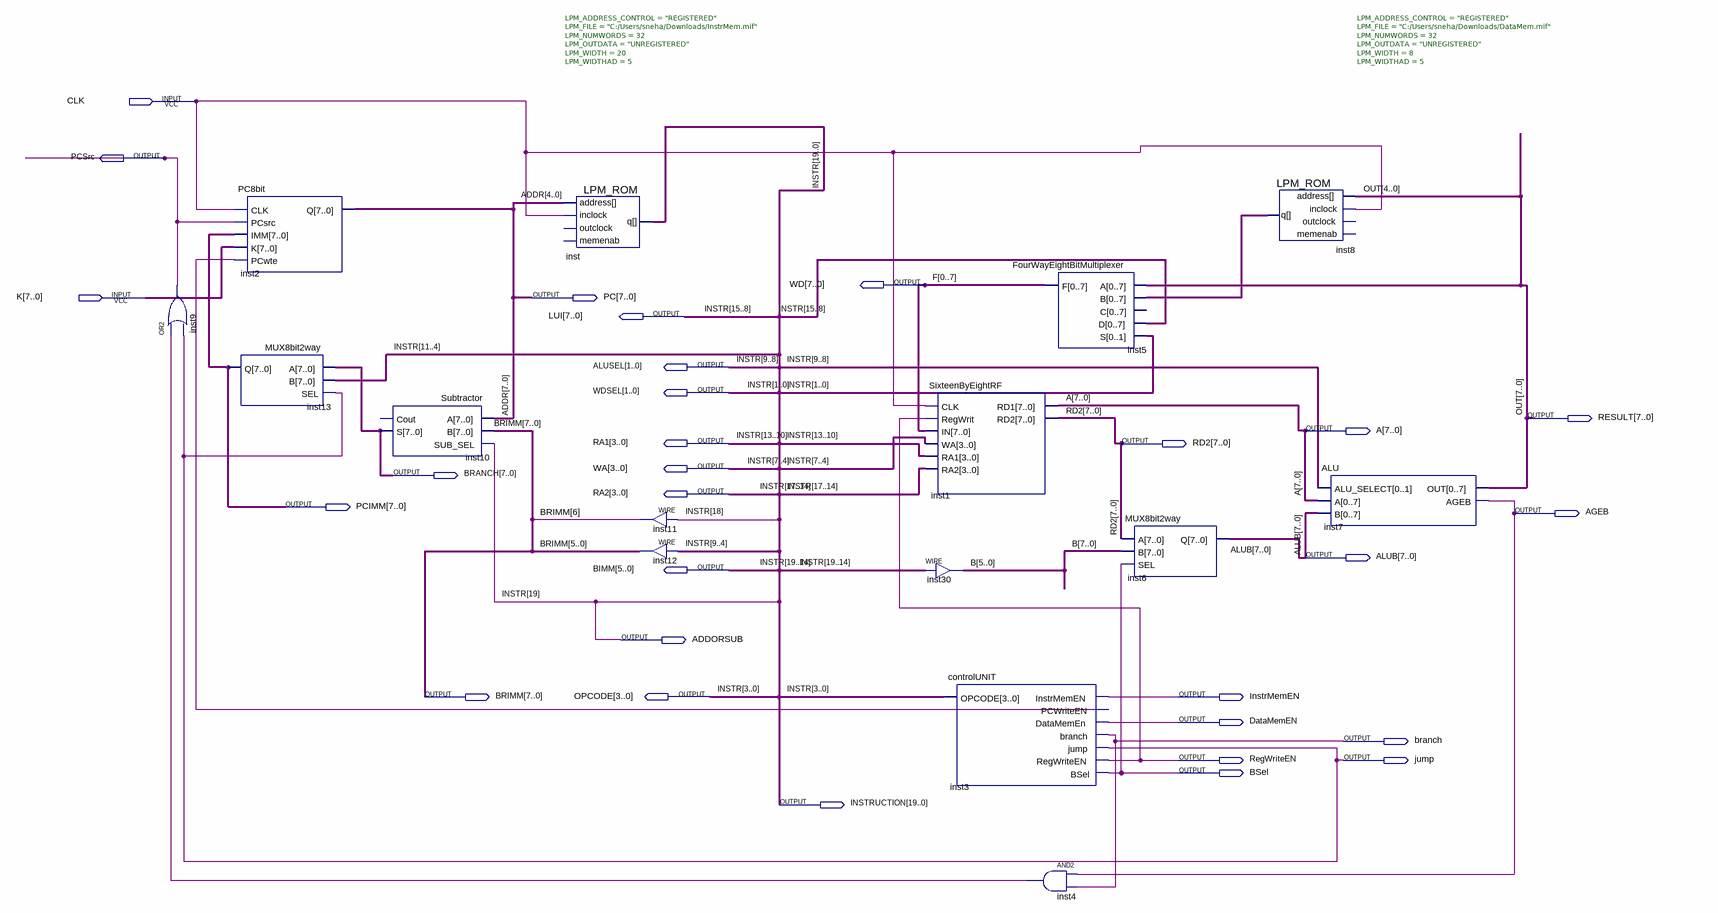
[diagram p0: schematic sheet]
// Quartus schematic DATAPATH03.bdf as structural Verilog: 15 symbols, 29 pins
module DATAPATH03 (
  input  CLK,
  input  [7:0] K,
  output PCSrc,
  output [7:0] WD,
  output [7:0] PC,
  output [7:0] LUI,
  output [1:0] ALUSEL,
  output [1:0] WDSEL,
  output [7:0] RESULT,
  output [7:0] A,
  output [3:0] RA1,
  output [7:0] RD2,
  output [3:0] WA,
  output [7:0] branch,
  output [3:0] RA2,
  output [7:0] PCIMM,
  output AGEB,
  output [7:0] ALUB,
  output [5:0] BIMM,
  output ADDORSUB,
  output [7:0] BRIMM,
  output [3:0] OPCODE,
  output InstrMemEN,
  output DataMemEN,
  output branch_1bit,
  output RegWriteEN,
  output jump,
  output BSel,
  output [19:0] INSTRUCTION
);

  wire inst3_pcwriteen, inst4_out;
  wire [7:0] B, inst8_q;

  or inst9 (PCSrc, inst4_out, jump);
  PC8bit inst2 (.CLK(CLK), .PCsrc(PCSrc), .IMM(PCIMM), .K(K), .PCwte(inst3_pcwriteen), .Q(PC));
  MUX8bit2way inst13 (.A(branch), .B({INSTRUCTION[11:10], ALUSEL, INSTRUCTION[7:4]}), .SEL(jump), .Q(PCIMM));
  Subtractor inst10 (.A(PC), .B(BRIMM), .SUB_SEL(ADDORSUB), .S(branch));  // open: Cout
  LPM_ROM #(.LPM_ADDRESS_CONTROL("REGISTERED"), .LPM_FILE("C:/Users/sneha/Downloads/InstrMem.mif"), .LPM_NUMWORDS(32), .LPM_OUTDATA("UNREGISTERED"), .LPM_WIDTH(20), .LPM_WIDTHAD(5)) inst (
    .address(PC[4:0]), .inclock(CLK), .q({ADDORSUB, BIMM[4:0], INSTRUCTION[13:10], ALUSEL, INSTRUCTION[7:0]}));  // open: outclock, memenab
  assign BRIMM[6] = BIMM[4];  // WIRE inst11
  assign BRIMM[5:0] = {ALUSEL, INSTRUCTION[7:4]};  // WIRE inst12
  SixteenByEightRF inst1 (
    .CLK(CLK), .RegWrit(RegWriteEN), .IN(WD), .WA(INSTRUCTION[7:4]), .RA1(INSTRUCTION[13:10]),
    .RA2(BIMM[3:0]), .RD1(A), .RD2(RD2));
  assign B[5:0] = {ADDORSUB, BIMM[4:0]};  // WIRE inst30
  controlUNIT inst3 (
    .OPCODE(INSTRUCTION[3:0]), .InstrMemEN(InstrMemEN), .PCWriteEN(inst3_pcwriteen), .DataMemEn(DataMemEN),
    .branch(branch_1bit), .jump(jump), .RegWriteEN(RegWriteEN), .BSel(BSel));
  and inst4 (inst4_out, AGEB, branch_1bit);
  FourWayEightBitMultiplexer inst5 (
    .A(RESULT), .B(inst8_q), .D({BIMM[1:0], INSTRUCTION[13:10], ALUSEL}), .S(INSTRUCTION[1:0]), .F(WD));  // open: C
  MUX8bit2way inst6 (.A(RD2), .B(B), .SEL(BSel), .Q(ALUB));
  LPM_ROM #(.LPM_ADDRESS_CONTROL("REGISTERED"), .LPM_FILE("C:/Users/sneha/Downloads/DataMem.mif"), .LPM_NUMWORDS(32), .LPM_OUTDATA("UNREGISTERED"), .LPM_WIDTH(8), .LPM_WIDTHAD(5)) inst8 (
    .address(RESULT[4:0]), .inclock(CLK), .q(inst8_q));  // open: outclock, memenab
  ALU inst7 (.ALU_SELECT(ALUSEL), .A(A), .B(ALUB), .OUT(RESULT), .AGEB(AGEB));

  assign BIMM[5] = ADDORSUB;
  assign {INSTRUCTION[19:14], INSTRUCTION[9:8]} = {ADDORSUB, BIMM[4:0], ALUSEL};
  assign LUI = {BIMM[1:0], INSTRUCTION[13:10], ALUSEL};
  assign OPCODE = INSTRUCTION[3:0];
  assign RA1 = INSTRUCTION[13:10];
  assign RA2 = BIMM[3:0];
  assign WA = INSTRUCTION[7:4];
  assign WDSEL = INSTRUCTION[1:0];

  // Other names for the same wires on the sheet: ADDR[7:0] = PC;
  //   INSTR[19:0] = {ADDORSUB, BIMM[4:0], INSTRUCTION[13:10], ALUSEL, INSTRUCTION[7:0]}; OUT[7:0] = RESULT;
  //   F[7:0] = {WD[0], WD[1], WD[2], WD[3], WD[4], WD[5], WD[6], WD[7]}
endmodule
